# Altium schematic sheet Power.SchDoc
size A4
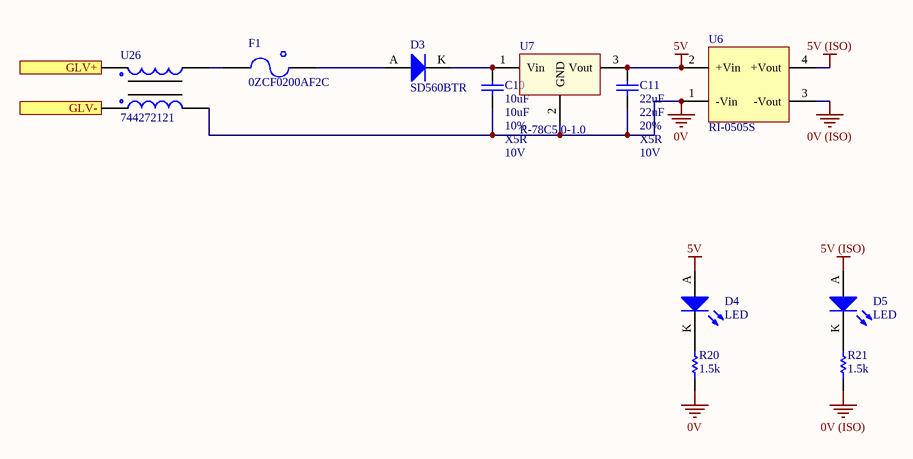
[diagram p0: Power.SchDoc]

## Parts
C10  10uF  Tolerance: 10%  Material: X5R  Rated Voltage: 10V  [0805]
C11  22uF  Tolerance: 20%  Material: X5R  Rated Voltage: 10V  [0805]
D3  SD560BTR  [SMB Diode]
D4  LED  [0805 LED]
D5  LED  [0805 LED]
F1  0ZCF0200AF2C  [2920]
R20  1.5k  [0805]
R21  1.5k  [0805]
U6  RI-0505S  [RECOM 4-SIP]
U7  R-78C5.0-1.0  [RECOM 3-SIP]
U26  744272121  [Wurth 4-PC Pad]

## Ports
GLV+, GLV-

## Nets
0V: C10.1 C11.1 R20.1 U6.1(-Vin) U7.2(GND) U26.3
0V (ISO): R21.1 U6.3(-Vout)
5V: C11.2 D4.A U6.2(+Vin) U7.3(Vout)
5V (ISO): D5.A U6.4(+Vout)
GLV+: U26.1 ; port GLV+
GLV-: U26.4 ; port GLV-
NetC10_2: C10.2 D3.K U7.1(Vin)
NetD3_A: D3.A F1.2
NetD4_K: D4.K R20.2
NetD5_K: D5.K R21.2
NetF1_1: F1.1 U26.2

## Library data of the parts
C10 = GCM21BR61A106KA37L: Manufacturer: muRata; Value: 10uF; Part Number: GCM21BR61A106KA37L
C11 = GRM21BR61A226ME51L: Manufacturer: muRata; Value: 22uF; Digikey Part Number: 490-10511-1-ND; Part Number: GRM21BR61A226ME51L
D3 = SD560BTR: 1.2V_F 600V 5A SMB; Manufacturer: SMC Diode Solutions; Part Number: SD560BTR; Digikey Part Number: 1655-1530-2-ND; Digikey Link: https://www.digikey.com/product-detail/en/smc-diode-solutions/SD560BTR/1655-1530-2-ND/6022620
D4 D5 = SML-210LTT86: Red LED Indication - Discrete 1.75V 0805 (2012 Metric); Manufacturer: ROHM Semiconductor; Part Number: SML-210LTT86; Colour: Red; Digikey Part Number: 511-1286-1-ND; Digikey Link: https://www.digikey.com/product-detail/en/rohm-semiconductor/SML-210LTT86/511-1286-1-ND/637099
F1 = 0ZCF0200AF2C: SMD 24V 2A Fuse; Manufacturer: Bel Fuse Inc; Part Number: 0ZCF0200AF2C; Digikey Part Number: 507-1749-2-ND; Digikey Link: https://www.digikey.com/product-detail/en/bel-fuse-inc/0ZCF0200AF2C/507-1749-2-ND/4156090
R20 R21 = RC0805FR071K5L: Manufacturer: YAGEO; Tolerance: 0.01; Rated Voltage: 0.125W; Part Number: RC0805FR071K5L; Value: 1.5k; Material: FR-07; qty: 50
U6 = RI-0505S: 5V DC-DC Converter (2W); Manufacturer: Recom; Part Number: RI-0505S; Digikey Part Number: 945-1189-ND; Digikey Link: https://www.digikey.com/product-detail/en/recom-power/RI-0505S/945-1189-ND/2256369
U7 = R-78C5.0-1.0: CONV DC/DC 1A 5V OUT SIP VERT; Manufacturer: Recom; Part Number: R-78C5.0-1.0; Digikey Part Number: 945-1395-5-ND; Digikey Link: https://www.digikey.com.au/product-detail/en/recom-power/R-78C5.0-1.0/945-1395-5-ND/2652148
U26 = 744272121: Common Mode Choke 120UH 2.5A 2LN 460 OHM SMD; Manufacturer: Wurth Electronics Inc; Part Number: 744272121; Digikey Part Number: 732-1489-2-ND; Digikey Link: https://www.digikey.com/product-detail/en/wurth-electronics-inc/744272121/732-1489-2-ND/1638893